# EAGLE schematic SCh H bridge (EAGLE 9.5.1)
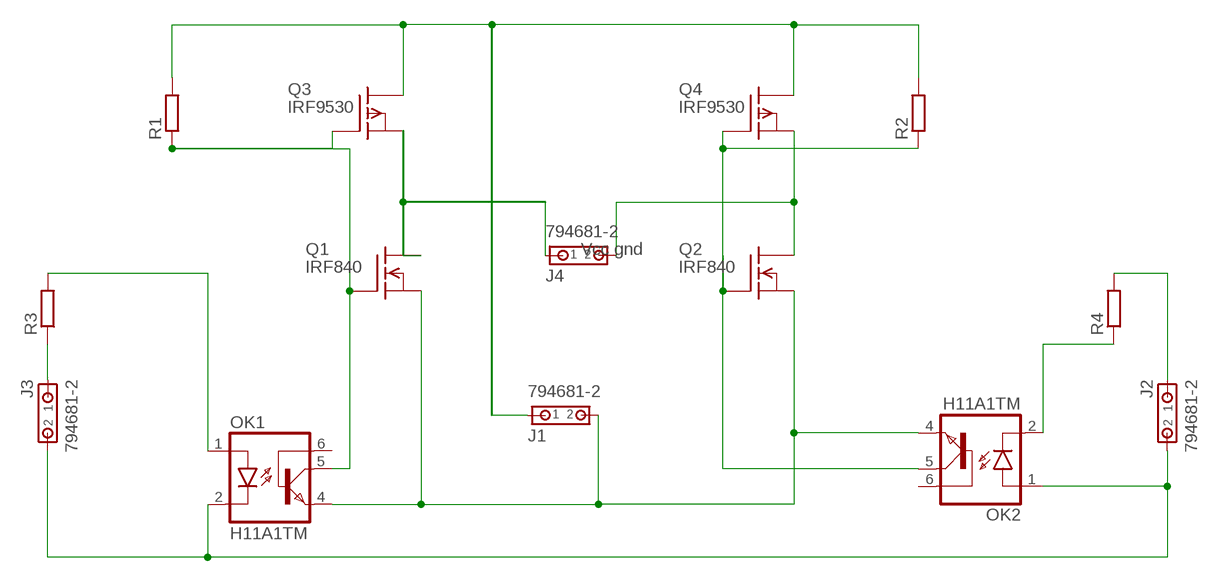
[diagram p0: schematic, sheet 1]

## Parts
J1  794681-2  [794681-2]
J2  794681-2  [794681-2]
J3  794681-2  [794681-2]
J4  794681-2  [794681-2]
OK1  H11A1TM  [DIL6-04]
OK2  H11A1TM  [DIL6-04]
Q1  IRF840  [TO220]
Q2  IRF840  [TO220]
Q3  IRF9530  [TO220]
Q4  IRF9530  [TO220]
R1  R-EU_0309/12  [0309/12]
R2  R-EU_0309/12  [0309/12]
R3  R-EU_0309/12  [0309/12]
R4  R-EU_0309/12  [0309/12]

## Nets
N$1: J1.1 Q3.2(D) Q4.2(D) R1.2 R2.2
N$3: J1.2 OK1.4(EMI) OK2.4(EMI) Q1.3(S) Q2.3(S)
N$4: J4.2 Q2.2(D) Q4.3(S)
N$5: OK2.5(COL) Q2.1(G) Q4.1(G) R2.1
N$6: OK1.5(COL) Q1.1(G) Q3.1(G) R1.1
N$7: OK2.2(C) R4.1
N$8: J2.1 R4.2
N$9: J2.2 J3.2 OK1.2(C) OK2.1(A)
N$10: J3.1 R3.1
N$11: OK1.1(A) R3.2
N$12: J4.1 Q1.2(D) Q3.3(S)
Unconnected: OK1.6(BAS) OK2.6(BAS)

## Library data of the parts
J1-J4 = con-amp:794681-2: Micro MATE-N-LOK Connectors grid 1.5mm Dual Row Through Hole Vertical Metal Through Hole Holddowns Source: ENG_CD_794681_E.pdf
OK1 OK2 = optocoupler:H11A*?M: General Purpose 6-Pin Phototransistor Optocouplers Source: http://www.fairchildsemi.com/ds/4N/4N35-M.pdf; MF: FAIRCHILD SEMICONDUCTOR; MPN: H11A1TV-M; OC_FARNELL: unknown; OC_NEWARK: 05C2394
Q1 Q2 = transistor-fet:IRF840: N-Channel Enhancement MOSFET (HEXFET); 500V; 8A; 0,85Ohm
Q3 Q4 = transistor-fet:IRF9530: P-Channel Enhancement MOSFET (HEXFET); -100V; -12A; 0,3Ohm
R1-R4 = rcl:R-EU_: RESISTOR, European symbol; SPICEPREFIX: R